# EasyEDA schematic SCH_InfoBar-(ESP8266-12F)_2024-08-24.json
TITLE: InfoBar (Untested); REV: 1.0; Date: 24-08-2024; Sheet: 1/1; Drawn By: Edward Keate; Company: Stoke PEV Solutions UK LLP
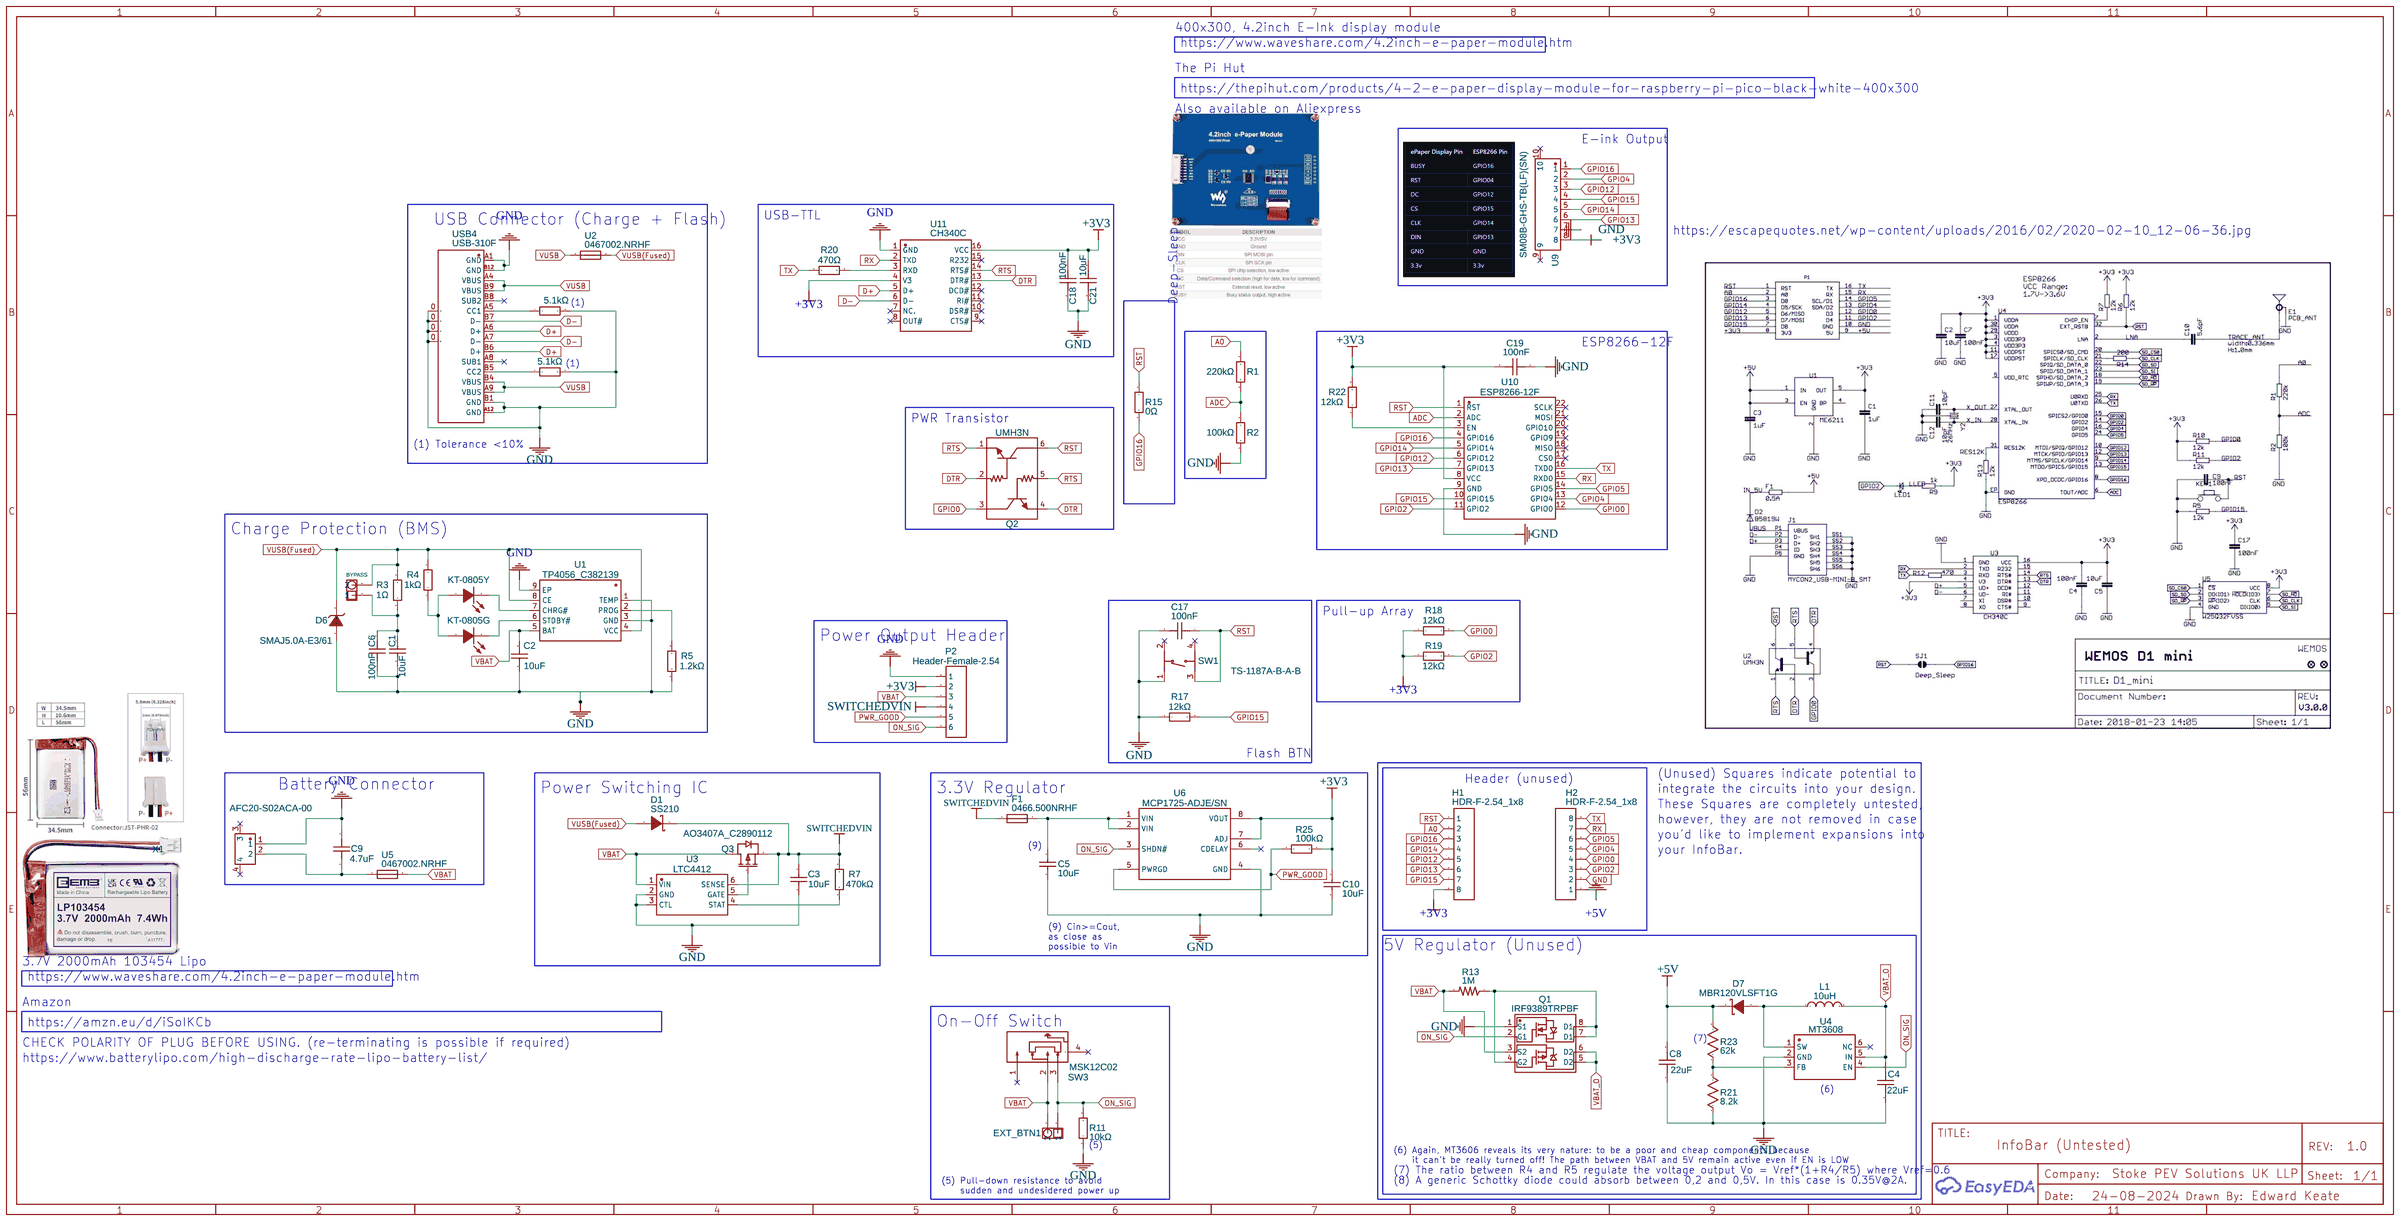
[diagram p0: schematic sheet]

## Parts
BYPASS  Just a couple of 2.54-spaced pins  [1X02 2.54MM HOLES HEADERS PINS]
C1  10uF  [C0402]
C2  10uF  [C0402]
C3  10uF  [C0402]
C4  22uF  [C0603]
C5  10uF  [C0402]
C6  100nF  [C0603]
C8  22uF  [C0603]
C9  4.7uF  [C0603]
C10  10uF  [C0402]
C17  100nF  [C0603]
C18  100nF  [C0603]
C19  100nF  [C0603]
C21  10uF  [C0603]
D1  SS210  [SMA_L4.3-W2.6-LS5.2-RD]
D6  SMAJ5.0A-E3/61  [SMA_L4.3-W2.6-LS5.2-RD]
D7  MBR120VLSFT1G  [SOD-123F_L2.8-W1.8-LS3.7-RD]
EXT_BTN1  Just a couple of 2.54-spaced pins  [1X02 2.54MM HOLES HEADERS PINS]
F1  0466.500NRHF  [F1206]
H1  HDR-F-2.54_1x8  [HDR-F-2.54_1X8]
H2  HDR-F-2.54_1x8  [HDR-F-2.54_1X8]
L1  10uH  [L2020]
LED2  KT-0805G  [LED0805-R-RD]
LED3  KT-0805Y  [LED0805-R-RD]
P2  Header-Female-2.54  [HDR-6X1/2.54]
Q1  IRF9389TRPBF  [SOIC-8_L4.9-W3.9-P1.27-LS6.0-BL]
Q2  UMH3N  [SC-70-6_L2.2-W1.3-P0.65-LS2.1-BR]
Q3  AO3407A_C2890112  [SOT-23-3_L2.9-W1.3-P1.90-LS2.4-BR]
R1  220kΩ  [R0603]
R2  100kΩ  [R0603]
R3  1Ω  [R0805]
R4  1kΩ  [R0603]
R5  1.2kΩ  [R0603]
R7  470kΩ  [R0603]
R10  5.1kΩ  [R0402]
R11  10kΩ  [R0603]
R13  1M  [R0603]
R15  0Ω  [R0603]
R17  12kΩ  [R0603]
R18  12kΩ  [R0603]
R19  12kΩ  [R0603]
R20  470Ω  [R0603]
R21  8.2k  [R0603]
R22  12kΩ  [R0603]
R23  62k  [R0603]
R25  100kΩ  [R0603]
R26  5.1kΩ  [R0402]
SW1  TS-1187A-B-A-B  [SW-SMD_4P-L5.1-W5.1-P3.70-LS6.5-TL-2]
SW3  MSK12C02  [SW-TH_MSK12C02]
U1  TP4056_C382139  [ESOP-8_L4.9-W3.9-P1.27-LS6.0-BL-EP]
U2  0467002.NRHF  [F0603]
U3  LTC4412  [SOT-23-6_L2.9-W1.6-P0.95-LS2.8-BL]
U4  MT3608  [SOT-23-6_L2.9-W1.6-P0.95-LS2.8-BR]
U5  0467002.NRHF  [F0603]
U6  MCP1725-ADJE/SN  [SOIC-8_L4.9-W3.9-P1.27-LS6.0-BL]
U9  SM08B-GHS-TB(LF)(SN)  [CONN-SMD_SM08B-GHS-TB-LF-SN]
U10  ESP8266-12F  [WIFIM-SMD_ESP-12F-ESP8266MOD]
U11  CH340C  [SOP-16_L10.0-W3.9-P1.27-LS6.0-BL]
USB4  USB-310F  [USB-C-SMD_20P-P0.50-L6.5-W8.9]
X1  AFC20-S02ACA-00  [CONN-SMD_AFC20-S02ACA-00]

## Library data of the parts
BYPASS EXT_BTN1 = -: Contributor: fabiano.riccardi; Manufacturer Part: ?
C1-C3 C5 C10 = CL05A106MQ5NUNC: Supplier: LCSC; Manufacturer: SAMSUNG(三星); Supplier Part: C15525; JLCPCB Part Class: Basic Part
C4 C8 C9 = Cap_RAD-0.1_US: Manufacturer Part: ?
C6 C17-C19 = CC0603KRX7R9BB104: Supplier: LCSC; Manufacturer: YAGEO(国巨); Supplier Part: C14663; JLCPCB Part Class: Basic Part
C21 = CL10A106KP8NNNC: Supplier: LCSC; Manufacturer: SAMSUNG(三星); Supplier Part: C19702; JLCPCB Part Class: Basic Part
D1 = SS210: Supplier: LCSC; Manufacturer: MDD(辰达半导体); Supplier Part: C14996; JLCPCB Part Class: Basic Part
D6 = SMAJ5.0A-E3/61: Supplier: LCSC; Manufacturer: VISHAY(威世); Supplier Part: C89363; JLCPCB Part Class: Extended Part
D7 = MBR120VLSFT1G: Supplier: LCSC; Supplier Part: C223608; Manufacturer: ON Semicon; Contributor: LCSC; LCSC Assembly: Yes; SMT Type: Extend
F1 = 0466.500NRHF: Contributor: LCSC; Supplier: LCSC; Supplier Part: C151133; Manufacturer: Littelfuse(美国力特); JLCPCB Part Class: Extended Part
H1 H2 = HDR-F-2.54_1x8: Supplier Part: C225505; Supplier: LCSC; Contributor: LCEDA_Lib
L1 = LQH5BPN100M38L: Supplier: LCSC; Supplier Part: C237555; Manufacturer: Murata Electronics; Contributor: LCSC
LED2 = 0805G (Green): Supplier: LCSC; Manufacturer: KENTO; Supplier Part: C2297; JLCPCB Part Class: Basic Part
LED3 = 17-21SUYC/TR8: Supplier: LCSC; Manufacturer: KENTO; Manufacturer Part: KT-0805黄灯; Supplier Part: C2296; JLCPCB Part Class: Basic Part
P2 = -: Supplier: LCSC; Manufacturer: BOOMELE; Manufacturer Part: Female header 1*6p; Supplier Part: C40877
Q1 = IRF9389TRPBF detailed: Supplier: LCSC; Manufacturer: Infineon; Contributor: LCSC; Supplier Part: C152654
Q2 = UMH3N: Supplier: LCSC; Manufacturer: CJ(江苏长电/长晶); Supplier Part: C62892; JLCPCB Part Class: Extended Part
Q3 = AO3407A_C2890112: Contributor: LCSC; Supplier: LCSC; Supplier Part: C2890112; Manufacturer: TECH PUBLIC(台舟); Manufacturer Part: AO3407A; JLCPCB Part Class: Extended Part
R1 = 0603WAF2203T5E: Supplier: LCSC; Manufacturer: UNI-ROYAL(厚声); Supplier Part: C22961; JLCPCB Part Class: Basic Part
R2 R25 = 0603WAF1003T5E: Supplier: LCSC; Manufacturer: UNI-ROYAL(厚声); Supplier Part: C25803; JLCPCB Part Class: Basic Part
R3 = 0805W8F100KT5E: Supplier: LCSC; Manufacturer: UNI-ROYAL(厚声); Supplier Part: C25271; JLCPCB Part Class: Basic Part
R4 = 0603WAF1001T5E: Supplier: LCSC; Manufacturer: UNI-ROYAL(厚声); Supplier Part: C21190; JLCPCB Part Class: Basic Part
R5 = 0603WAF1201T5E: Supplier: LCSC; Manufacturer: UNI-ROYAL(厚声); Supplier Part: C22765; JLCPCB Part Class: Basic Part
R7 = 0603WAF4703T5E: Supplier: LCSC; Manufacturer: UNI-ROYAL(厚声); Supplier Part: C23178; JLCPCB Part Class: Basic Part
R10 R26 = 0402WGF5101TCE: Supplier: LCSC; Manufacturer: UNI-ROYAL(厚声); Supplier Part: C25905; JLCPCB Part Class: Basic Part
R11 = 0603WAF1002T5E: Supplier: LCSC; Manufacturer: UNI-ROYAL(厚声); Supplier Part: C25804; JLCPCB Part Class: Basic Part
R15 = 0603WAF0000T5E: Supplier: LCSC; Manufacturer: UNI-ROYAL(厚声); Supplier Part: C21189; JLCPCB Part Class: Basic Part
R17-R19 R22 = 0603WAF1202T5E: Supplier: LCSC; Manufacturer: UNI-ROYAL(厚声); Supplier Part: C22790; JLCPCB Part Class: Basic Part
R20 = 0603WAF4700T5E: Supplier: LCSC; Manufacturer: UNI-ROYAL(厚声); Supplier Part: C23179; JLCPCB Part Class: Basic Part
R21 R23 = Res_AXIAL-0.3(1/8W)_US: Manufacturer Part: ?
SW1 = TS-1187A-B-A-B: Contributor: LCSC; Supplier: LCSC; Supplier Part: C318884; Manufacturer: XKB Connectivity(中国星坤); JLCPCB Part Class: Basic Part
SW3 = MSK12C02: Contributor: LCSC; Supplier: LCSC; Supplier Part: C431540; Manufacturer: SHOU HAN(首韩); JLCPCB Part Class: Extended Part
U1 = TP4056_C382139: Contributor: LCSC; Supplier: LCSC; Supplier Part: C382139; Manufacturer: TPOWER(天源); Manufacturer Part: TP4056; JLCPCB Part Class: Extended Part
U2 U5 = 0467002.NRHF: Contributor: LCSC; Supplier: LCSC; Supplier Part: C187605; Manufacturer: Littelfuse(美国力特); JLCPCB Part Class: Extended Part
U3 = LTC4412IS6#TRPBF_C521306: Contributor: LCSC; Supplier: LCSC; Supplier Part: C521306; Manufacturer: ADI(亚德诺); Manufacturer Part: LTC4412IS6#TRPBF; JLCPCB Part Class: Extended Part
U4 = MT3608: Supplier: LCSC; Manufacturer: AEROSEMI; Supplier Part: C84817; SMT Type: Extend; JLCPCB SMD: Yes
U6 = MCP1725-ADJE/SN: Contributor: LCSC; Supplier: LCSC; Manufacturer: MICROCHIP(美国微芯); Supplier Part: C148041; JLCPCB Part Class: Extended Part
U9 = SM08B-GHS-TB(LF)(SN): Contributor: LCSC; Supplier: LCSC; Supplier Part: C265111; Manufacturer: JST; JLCPCB Part Class: Extended Part
U10 = ESP-12F(ESP8266MOD): Supplier: LCSC; Manufacturer: Ai-Thinker(安信可); Supplier Part: C82891; JLCPCB Part Class: Extended Part
U11 = CH340C: Supplier: LCSC; Manufacturer: WCH(南京沁恒); Supplier Part: C84681; JLCPCB Part Class: Extended Part
USB4 = USB-310F: Contributor: LCSC; Supplier: LCSC; Supplier Part: C309365; Manufacturer: HOOYA(皓宇电子); Manufacturer Part: USB-310F-B-SU; JLCPCB Part Class: Extended Part
X1 = AFC20-S02ACA-00: Contributor: LCSC; Supplier: LCSC; Supplier Part: C2764211; Manufacturer: JS(钜硕电子); JLCPCB Part Class: Extended Part

## Nets
+3V3: C10.1 C18.2 C19.2 C21.1 H1.8 P2.2 R18.1 R19.1 R22.2 R25.2 U6.7(ADJ) U6.8(VOUT) U9.8 U10.8(VCC) U11.4(V3) U11.16(VCC)
+5V: C8.2 D7.1(K) H2.1 R23.2
GND: C1.2 C2.2 C3.2 C4.1 C5.2 C6.2 C8.1 C9.1 C10.2 C17.2 C18.1 C19.1 C21.2 D6.2(A) H2.2 P2.1 Q1.1(S1) R2.2 R5.2 R10.2 R11.1 R17.1 R21.1 R26.2 SW1.1(A) U1.1(TEMP) U1.3(GND) U1.9(EP) U3.2(GND) U3.3(CTL) U4.2(GND) U6.4(GND) U9.7 U10.9(GND) U11.1(GND) USB4.0 USB4.A1(GND) USB4.A12(GND) USB4.B1(GND) USB4.B12(GND) X1.1
VBAT: C2.1 EXT_BTN1.2 P2.3 Q1.3(S2) Q3.3(D) R13.2 SW3.2 U1.5(BAT) U3.1(VIN) U5.2
VBAT_O: C4.2 L1.2 Q1.5(D2) Q1.6(D2) U4.5(IN)
A0: H1.2 R1.1
ADC: R1.2 R2.1 U10.2(ADC)
D+: U11.5(D+) USB4.A6(D+) USB4.B6(D+)
D-: U11.6(D-) USB4.A7(D-) USB4.B7(D-)
DTR: Q2.2(B) Q2.4(E) U11.13(DTR#)
GPIO0: H2.4 Q2.3(C) R18.2 U10.12(GPIO0)
GPIO2: H2.3 R19.2 U10.11(GPIO2)
GPIO4: H2.5 U9.2 U10.13(GPIO4)
GPIO5: H2.6 U10.14(GPIO5)
GPIO12: H1.5 U9.3 U10.6(GPIO12)
GPIO13: H1.6 U9.6 U10.7(GPIO13)
GPIO14: H1.4 U9.5 U10.5(GPIO14)
GPIO15: H1.7 R17.2 U9.4 U10.10(GPIO15)
GPIO16: H1.3 R15.2 U9.1 U10.4(GPIO16)
ON_SIG: EXT_BTN1.1 P2.6 Q1.2(G1) R11.2 SW3.3 U4.4(EN) U6.3(SHDN#)
PWR_GOOD: P2.5 R25.1 U6.5(PWRGD)
RST: C17.1 H1.1 Q2.6(C) R15.1 SW1.3(C) U10.1(RST)
RTS: Q2.1(E) Q2.5(B) U11.14(RTS#)
RX: H2.7 U10.15(RXD0) U11.2(TXD)
SWITCHEDVIN: C3.1 D1.1(K) F1.1 P2.4 Q3.2(S) R7.2 U3.6(SENSE)
TX: H2.8 R20.1 U10.16(TXD0)
VUSB: U2.1 USB4.A4(VBUS) USB4.A9(VBUS) USB4.B4(VBUS) USB4.B9(VBUS)
VUSB(Fused): BYPASS.2 D1.2(A) D6.1(C) R3.1 R4.2 U1.4(VCC) U1.8(CE) U2.2
Net-(BYPASS-1): BYPASS.1 C1.1 C6.1 R3.2
Net-(C5-1): C5.1 F1.2 U6.1(VIN) U6.2(VIN)
Net-(C9-2): C9.2 U5.1 X1.2
Net-(D7-2): D7.2(A) L1.1 U4.1(SW)
Net-(LED2-1): LED2.1(A) LED3.1(+) R4.1
Net-(LED2-2): LED2.2(K) U1.6(STDBY#)
Net-(LED3-2): LED3.2(-) U1.7(CHRG#)
Net-(Q1-4): Q1.4(G2) Q1.7(D1) Q1.8(D1) R13.1
Net-(Q3-1): Q3.1(G) U3.5(GATE)
Net-(R5-1): R5.1 U1.2(PROG)
Net-(R7-1): R7.1 U3.4(STAT)
Net-(R10-1): R10.1 USB4.B5(CC2)
Net-(R20-2): R20.2 U11.3(RXD)
Net-(R21-2): R21.2 R23.1 U4.3(FB)
Net-(R22-1): R22.1 U10.3(EN)
Net-(R26-1): R26.1 USB4.A5(CC1)

Not connected (* = marked no-connect by the designer): SW1 2(B)* 4(D)*; SW3 1* 4*; U4 6(NC); U6 6(CDELAY); U9 9* 10*; U10 17(CS0)* 18(MISO)* 19(GPIO9)* 20(GPIO10)* 21(MOSI)* 22(SCLK)*; U11 7(NC.)* 8(OUT#)* 9(CTS#)* 10(DSR#)* 11(RI#)* 12(DCD#)* 15(R232)*; USB4 A8(SUB1) B8(SUB2); X1 3* 4*

## Notes on the sheet
- 400x300, 4.2inch E-Ink display module
- https://www.waveshare.com/4.2inch-e-paper-module.htm
- The Pi Hut
- https://thepihut.com/products/4-2-e-paper-display-module-for-raspberry-pi-pico-black-white-400x300
- Also available on Aliexpress
- E-ink Output
- USB Connector (Charge + Flash)
- USB-TTL
- https://escapequotes.net/wp-content/uploads/2016/02/2020-02-10_12-06-36.jpg
- (1)
- Deep-Sleep
- ESP8266-12F
- (1)
- PWR Transistor
- (1) Tolerance <10%
- Charge Protection (BMS)
- Pull-up Array
- Power Output Header
- Flash BTN
- Battery Connector
- Header (unused)
- (Unused) Squares indicate potential to
- Power Switching IC
- 3.3V Regulator
- integrate the circuits into your design.
- These Squares are completely untested,
- however, they are not removed in case
- you'd like to implement expansions into
- (9)
- your InfoBar.
- (9) Cin>=Cout,
  as close as
  possible to Vin
- 5V Regulator (Unused)
- 3.7V 2000mAh 103454 Lipo
- https://www.waveshare.com/4.2inch-e-paper-module.htm
- Amazon
- https://amzn.eu/d/iSoIKCb
- On-Off Switch
- CHECK POLARITY OF PLUG BEFORE USING. (re-terminating is possible if required)
- (7)
- https://www.batterylipo.com/high-discharge-rate-lipo-battery-list/
- (6)
- (5)
- (6) Again, MT3606 reveals its very nature: to be a poor and cheap components because
      it can't be really turned off! The path between VBAT and 5V remain active even if EN is LOW
- (7) The ratio between R4 and R5 regulate the voltage output Vo = Vref*(1+R4/R5) where Vref=0.6
- (5) Pull-down resistance to avoid
      sudden and undesidered power up
- (8) A generic Schottky diode could absorb between 0,2 and 0,5V. In this case is 0.35V@2A.
